# EAGLE schematic Autouke Schematic (EAGLE 9.6.1)
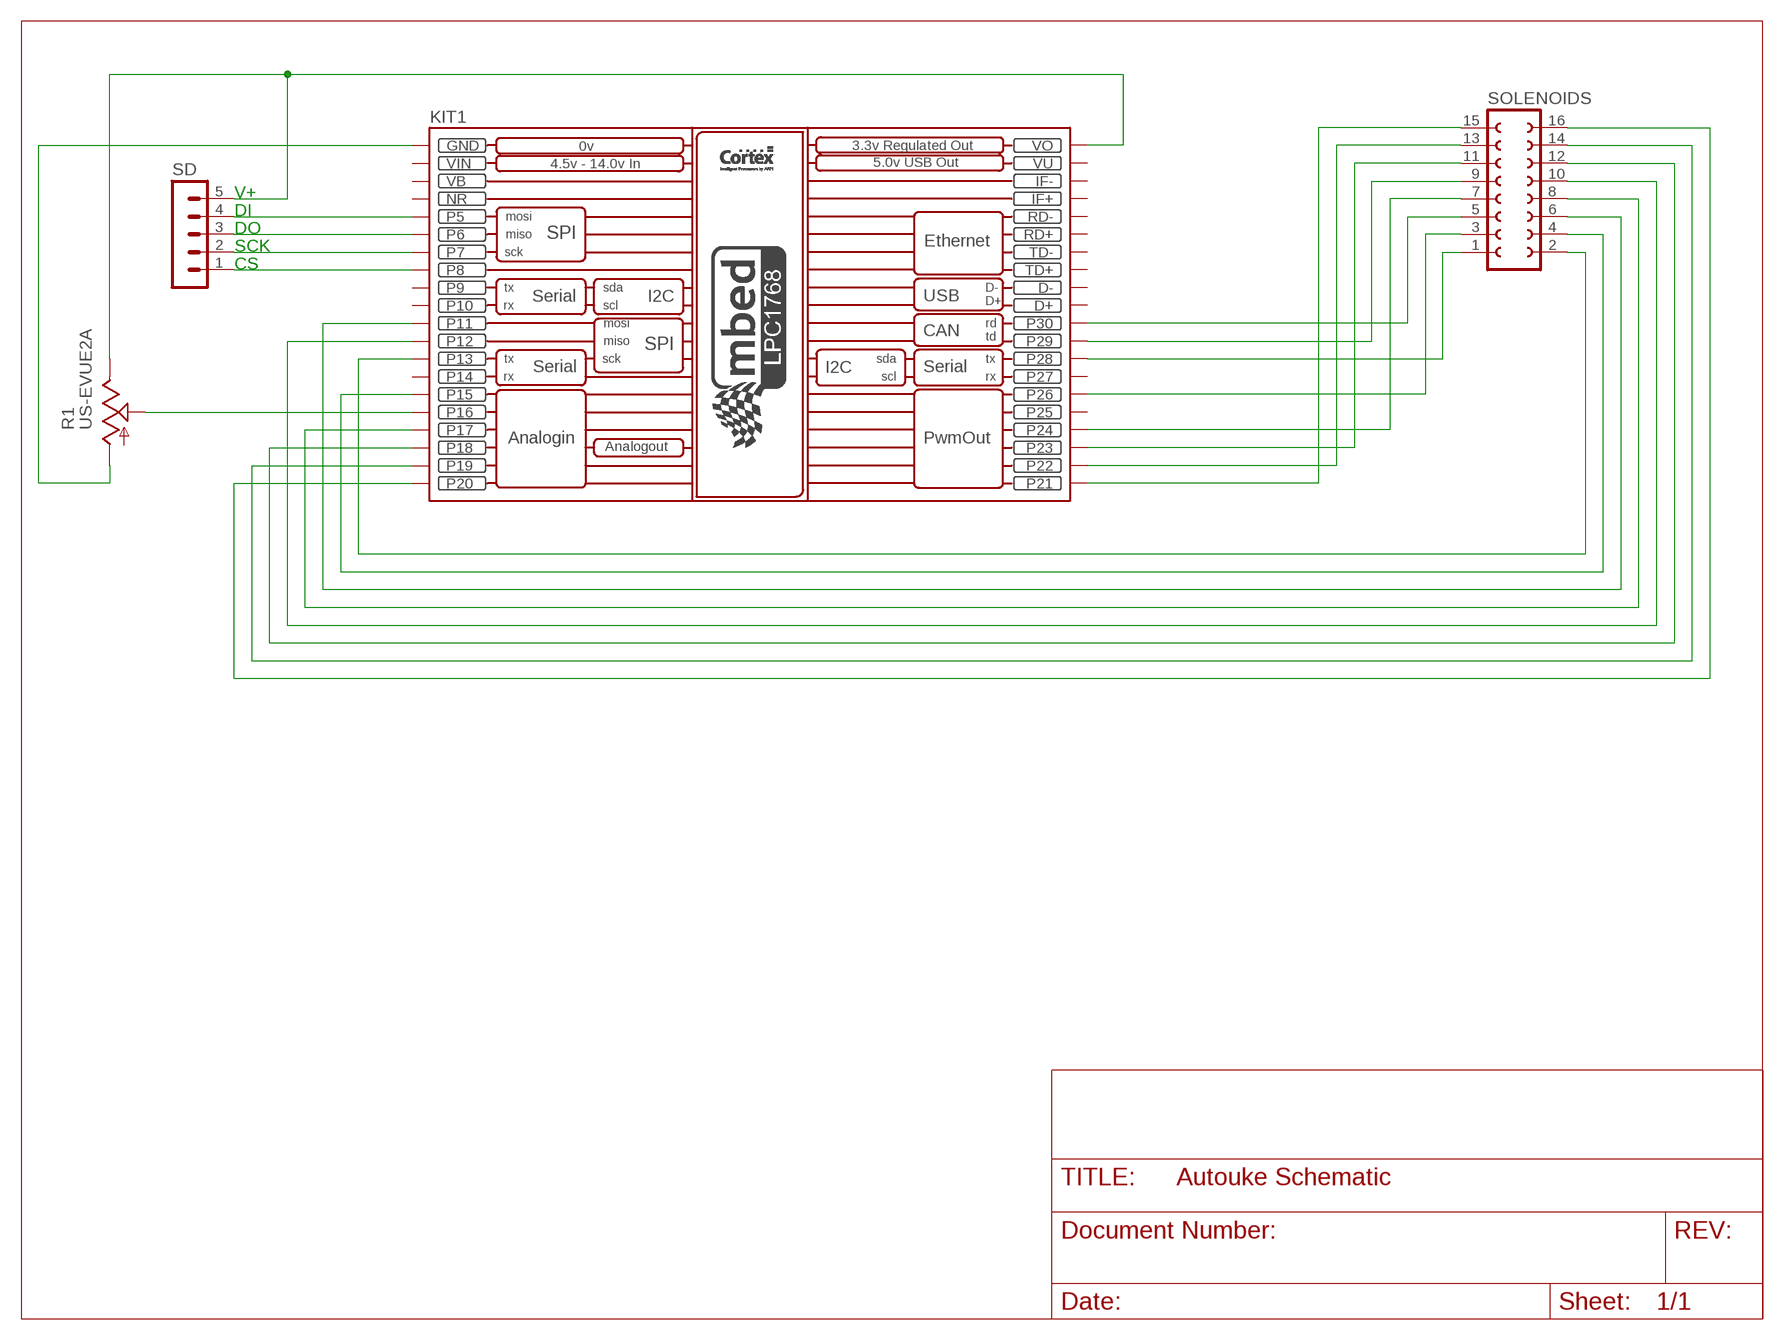
[diagram p0: schematic, sheet 1]

## Parts
KIT1  MBED_NXP_LPC1768  [MBED-KIT]
R1  US-EVUE2A  [EVUE]
SD  MA05-1  [MA05-1]
SOLENOIDS  FE08-2  [FE08-2]

## Nets
N$1: KIT1.P$16(P16) R1.2(S)
N$2: KIT1.VOUT(VO) R1.3(E) SD.5
N$3: KIT1.P$5(P5) SD.4
N$4: KIT1.P$6(P6) SD.3
N$5: KIT1.P$7(P7) SD.2
N$6: KIT1.P$8(P8) SD.1
N$7: KIT1.GND R1.1(A)
N$8: KIT1.P$28(P28) SOLENOIDS.1
N$9: KIT1.P$13(P13) SOLENOIDS.2
N$11: KIT1.P$15(P15) SOLENOIDS.4
N$12: KIT1.P$26(P26) SOLENOIDS.3
N$13: KIT1.P$11(P11) SOLENOIDS.6
N$14: KIT1.P$24(P24) SOLENOIDS.7
N$15: KIT1.P$17(P17) SOLENOIDS.8
N$16: KIT1.P$29(P29) SOLENOIDS.9
N$17: KIT1.P$12(P12) SOLENOIDS.10
N$18: KIT1.P$23(P23) SOLENOIDS.11
N$19: KIT1.P$18(P18) SOLENOIDS.12
N$20: KIT1.P$22(P22) SOLENOIDS.13
N$21: KIT1.P$19(P19) SOLENOIDS.14
N$22: KIT1.P$21(P21) SOLENOIDS.15
N$23: KIT1.P$20(P20) SOLENOIDS.16
N$24: KIT1.P$30(P30) SOLENOIDS.5
Unconnected: KIT1.D+ KIT1.D- KIT1.IF+ KIT1.IF- KIT1.P$9(P9) KIT1.P$10(P10) KIT1.P$14(P14) KIT1.P$25(P25) KIT1.P$27(P27) KIT1.RD+ KIT1.RD- KIT1.TD+ KIT1.TD-

## Notes on the sheet
- V+
- DI
- DO
- SCK
- CS

## Power pins joined to a net without a drawn wire
NR: KIT1.NR
VB: KIT1.VB
VIN: KIT1.VIN
VU: KIT1.VU

## Library data of the parts
KIT1 = MBED_v2.1:MBED_NXP_LPC1768: Mbed LPC1768 - ARM CORTEX v2.1 * Schematic symbol is now placed in eagles's default raster. *The pads diameter are suitable for routing between mbed pins * mbed pads are 0.8 mm drill diameter. --------------------------------------------- Created by: Mohamed Yousry *Alexandria, Egypt *Email: mohamed.yousry@ieeegoldegypt.org
R1 = pot:US-EVU: 9 mm Square Rotary Potentiometers Source: Panasonic
SD = con-lstb:MA05-1: PIN HEADER; OC_FARNELL: unknown; OC_NEWARK: unknown
SOLENOIDS = con-lsta:FE08-2: FEMALE HEADER; OC_FARNELL: unknown; OC_NEWARK: unknown